# Altium schematic sheet main.SchDoc
size 381 x 241 mm; SheetNumber: 1; SheetTotal: 13
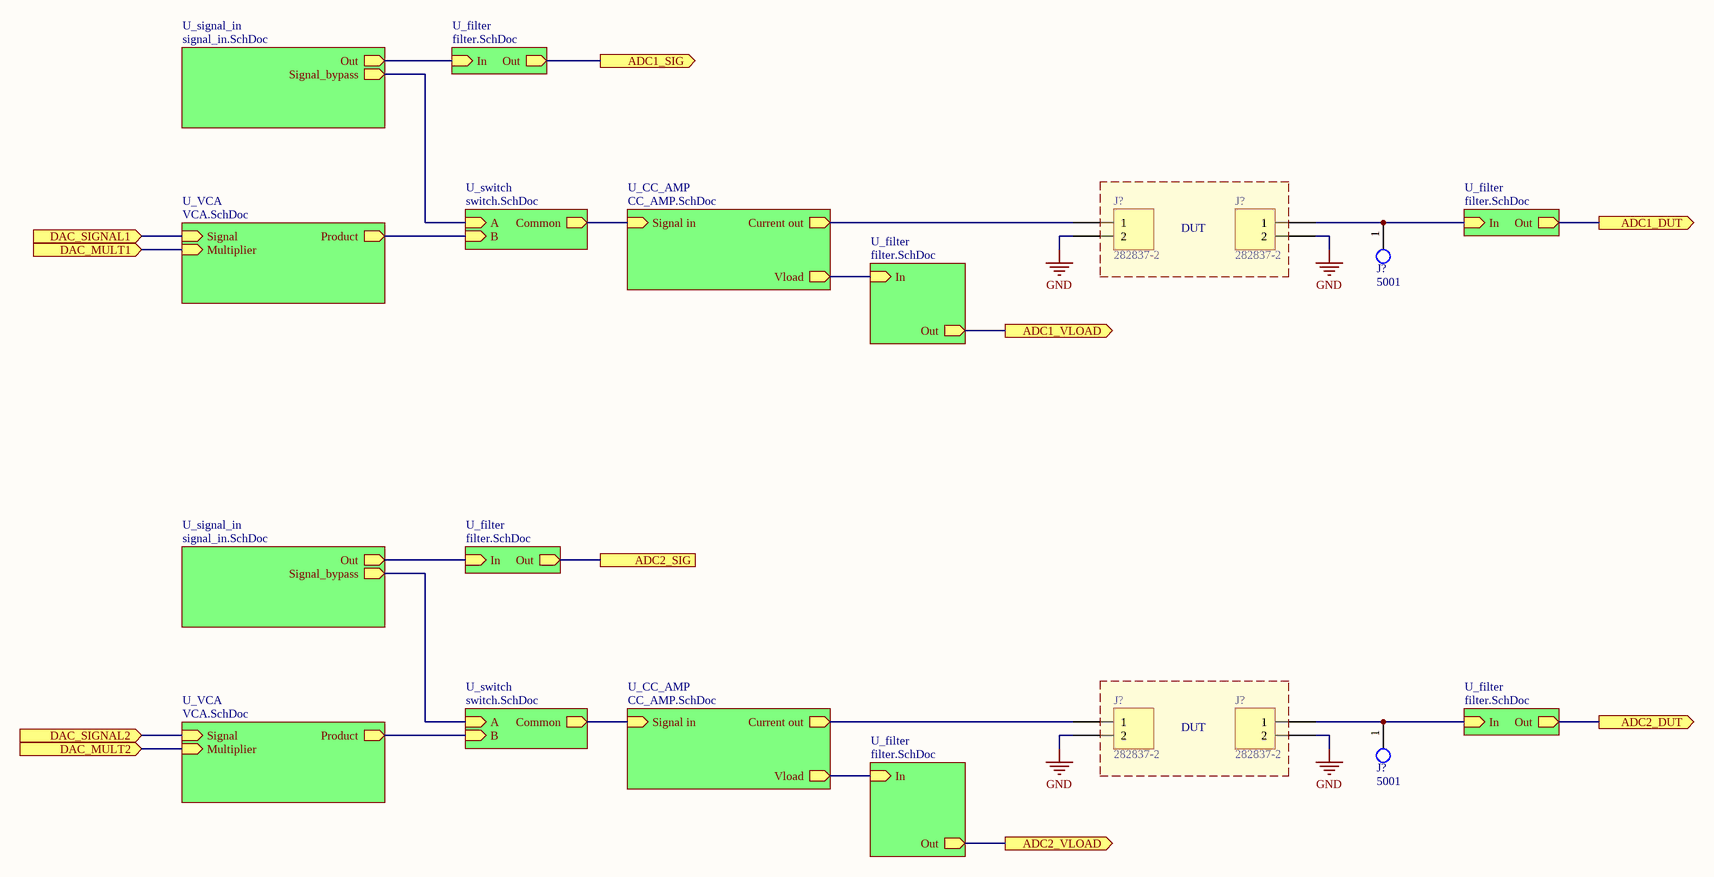
[diagram p0: main.SchDoc]

## Parts
(Parts that share a designator on the sheet are numbered #1, #2 ... from top to bottom, then left to right.)
J?#1  282837-2  [TE 282837-2]
J?#2  282837-2  [TE 282837-2]
J?#3  5001  [FP-5001-MFG]
J?#4  282837-2  [TE 282837-2]
J?#5  282837-2  [TE 282837-2]
J?#6  5001  [FP-5001-MFG]

## Blocks framed on the sheet
DUT: J?#1 J?#2
DUT: J?#4 J?#5

## Sub-sheets
U_CC_AMP = CC_AMP.SchDoc: Current out (out), Vload (out), Signal in (in)
U_CC_AMP = CC_AMP.SchDoc: Current out (out), Vload (out), Signal in (in)
U_filter = filter.SchDoc: Out (out), In (in)
U_filter = filter.SchDoc: Out (out), In (in)
U_filter = filter.SchDoc: Out (out), In (in)
U_filter = filter.SchDoc: Out (out), In (in)
U_filter = filter.SchDoc: Out (out), In (in)
U_filter = filter.SchDoc: Out (out), In (in)
U_signal_in = signal_in.SchDoc: Out (out), Signal_bypass (out)
U_signal_in = signal_in.SchDoc: Out (out), Signal_bypass (out)
U_switch = switch.SchDoc: B (in), A (in), Common (out)
U_switch = switch.SchDoc: B (in), A (in), Common (out)
U_VCA = VCA.SchDoc: Product (out), Signal (in), Multiplier (in)
U_VCA = VCA.SchDoc: Product (out), Signal (in), Multiplier (in)

## Ports
ADC1_DUT (out), ADC1_SIG (out), ADC1_VLOAD (out), ADC2_DUT (out), ADC2_SIG, ADC2_VLOAD (out), DAC_MULT1 (in), DAC_MULT2 (in), DAC_SIGNAL1 (in), DAC_SIGNAL2 (in)

## Nets
GND: J?#1.2 J?#2.2 J?#4.2 J?#5.2
ADC1_DUT: port ADC1_DUT, sheet U_filter/Out
ADC1_SIG: port ADC1_SIG, sheet U_filter/Out
ADC1_VLOAD: port ADC1_VLOAD, sheet U_filter/Out
ADC2_DUT: port ADC2_DUT, sheet U_filter/Out
ADC2_SIG: port ADC2_SIG, sheet U_filter/Out
ADC2_VLOAD: port ADC2_VLOAD, sheet U_filter/Out
DAC_MULT1: port DAC_MULT1, sheet U_VCA/Multiplier
DAC_MULT2: port DAC_MULT2, sheet U_VCA/Multiplier
DAC_SIGNAL1: port DAC_SIGNAL1, sheet U_VCA/Signal
DAC_SIGNAL2: port DAC_SIGNAL2, sheet U_VCA/Signal
NetJ?#1_1: J?#1.1 ; sheet U_CC_AMP/Current out
NetJ?#2_1: J?#2.1 J?#3.1 ; sheet U_filter/In
NetJ?#4_1: J?#4.1 ; sheet U_CC_AMP/Current out
NetJ?#5_1: J?#5.1 J?#6.1 ; sheet U_filter/In
(unnamed): sheet U_CC_AMP/Vload, sheet U_filter/In
(unnamed): sheet U_CC_AMP/Signal in, sheet U_switch/Common
(unnamed): sheet U_VCA/Product, sheet U_switch/B
(unnamed): sheet U_CC_AMP/Vload, sheet U_filter/In
(unnamed): sheet U_CC_AMP/Signal in, sheet U_switch/Common
(unnamed): sheet U_VCA/Product, sheet U_switch/B
(unnamed): sheet U_signal_in/Out, sheet U_filter/In
(unnamed): sheet U_signal_in/Signal_bypass, sheet U_switch/A
(unnamed): sheet U_signal_in/Out, sheet U_filter/In
(unnamed): sheet U_signal_in/Signal_bypass, sheet U_switch/A

## Library data of the parts
J?#1 J?#2 J?#4 J?#5 = 282837-2: TERM BLK 2P SIDE ENT 5.08MM PCB; Manufacturer: TE Connectivity AMP Connectors; Current: 13.5 A; Mating Orientation: Horizontal with Board; Number of Levels: 1; Pitch: 0.200" (5.08mm); Positions Per Level: 2; Voltage: 300 V; Wire Gauge: 16-28 AWG; Wire Termination: Screw - Rising Cage Clamp; Part Number: 282837-2; Color: Green; ComponentLink1Description: Datasheet; ComponentLink1URL: https://www.te.com/commerce/DocumentDelivery/DDEController?Action=srchrtrv&DocNm=282837&DocType=Customer+Drawing&DocLang=English; ComponentLink2Description: DigiKey Link; ComponentLink2URL: https://www.digikey.com/en/products/detail/te-connectivity-amp-connectors/282837-2/2187973; Features: Interlocking (Side); LastUpdated: 6/21/2022 15:00:23; Lifecycle Status: Active; Minimum Order: 1; Mounting Type: Through Hole; Packaging: Tray; Part Status: Active; Price: 0.31; Series: Buchanan; Supplier 1: DigiKey; Supplier Part Number 1: A113320-ND
J?#3 J?#6 = CMP-2000-05181-2: PC TEST POINT MINIATURE BLACK; Body Material: Bronze; Plating: Silver; Inside Diameter: 1.27mm; Hole Diameter: 1.6mm; Number of Ports: 1; Outside Diameter: 2.54mm; Insulation: Insulated; Insulation Material: Nylon; Mount: Through Hole; RoHS Compliant: Yes; Series: THM; Height: 0.3inch; Termination: Through Hole; Material: Nylon; Packaging: Bulk; Contact Material: Bronze; REACH SVHC: No SVHC; Contact Plating: Silver; Orientation: Straight; Lead Free: Lead Free; Package Quantity: 100; Length: 7.62mm; Flammability Rating: UL94 V-0; Number of Contacts: 1; Diameter: 2.54mm; Housing Color: Black; Color: Black